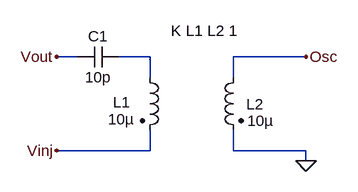
[diagram p0: schematic inj_transformer.asc]
inj_transformer.asc, the LTspice schematic file:
Version 4
SHEET 1 880 680
WIRE 16 80 -16 80
WIRE 128 80 80 80
WIRE 368 80 256 80
WIRE 128 112 128 80
WIRE 256 112 256 80
WIRE 128 224 128 192
WIRE 128 224 -16 224
WIRE 256 224 256 192
WIRE 368 224 256 224
WIRE 368 240 368 224
FLAG -16 80 Vout
FLAG -16 224 Vinj
FLAG 368 80 Osc
FLAG 368 240 0
SYMBOL ind2 112 96 R0
WINDOW 0 -41 54 Left 2
WINDOW 3 -49 80 Left 2
SYMATTR InstName L1
SYMATTR Value 10µ
SYMATTR Type ind
SYMBOL ind2 272 96 M0
WINDOW 0 -31 57 Left 2
WINDOW 3 -46 82 Left 2
SYMATTR InstName L2
SYMATTR Value 10µ
SYMATTR Type ind
SYMBOL cap 80 64 R90
WINDOW 0 0 32 VBottom 2
WINDOW 3 32 32 VTop 2
SYMATTR InstName C1
SYMATTR Value 10p
TEXT 160 40 Left 2 !K L1 L2 1

The netlist it stands for:
* inj_transformer.asc
L1 N001 Vinj 10µ
L2 Osc 0 10µ
C1 N001 Vout 10p
K L1 L2 1
.backanno
.end